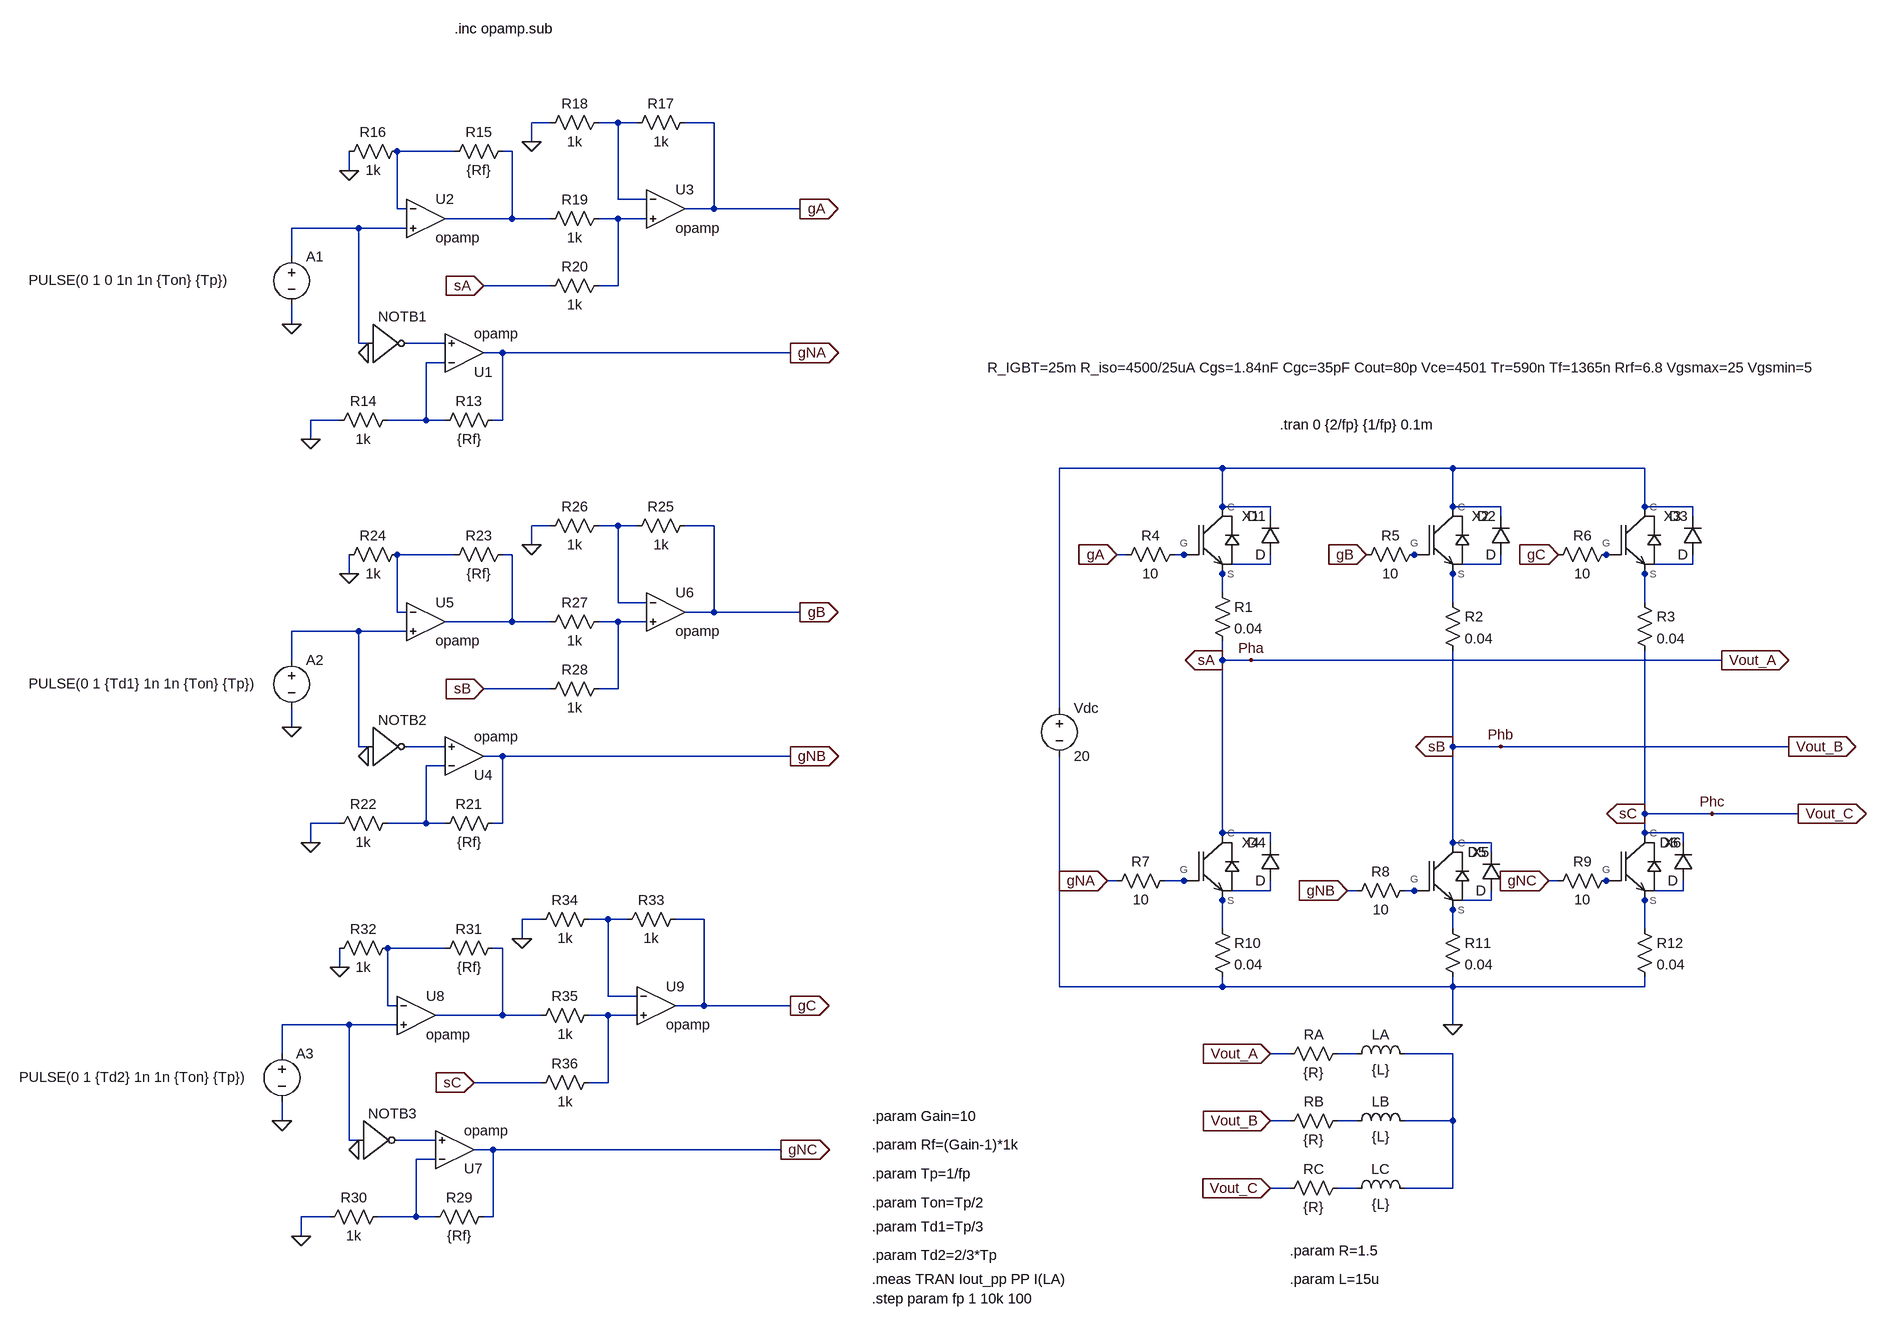
[diagram p0: schematic frequency_study_pp_IGBT.asc]
frequency_study_pp_IGBT.asc, the LTspice schematic file:
Version 4
SHEET 1 3328 1812
WIRE -1840 -1248 -1872 -1248
WIRE -1728 -1248 -1760 -1248
WIRE -1696 -1248 -1728 -1248
WIRE -1568 -1248 -1616 -1248
WIRE -1872 -1216 -1872 -1248
WIRE -2000 -1200 -2096 -1200
WIRE -1904 -1200 -1920 -1200
WIRE -2176 -1168 -2176 -1200
WIRE -1728 -1120 -1728 -1248
WIRE -1680 -1120 -1728 -1120
WIRE -2096 -1104 -2096 -1200
WIRE -2080 -1104 -2096 -1104
WIRE -1568 -1104 -1568 -1248
WIRE -1568 -1104 -1616 -1104
WIRE -1184 -1104 -1568 -1104
WIRE -1904 -1088 -1904 -1200
WIRE -1904 -1088 -2016 -1088
WIRE -1840 -1088 -1904 -1088
WIRE -1728 -1088 -1760 -1088
WIRE -1680 -1088 -1728 -1088
WIRE -2160 -1072 -2272 -1072
WIRE -2080 -1072 -2160 -1072
WIRE -2272 -1024 -2272 -1072
WIRE -1840 -976 -1952 -976
WIRE -1728 -976 -1728 -1088
WIRE -1728 -976 -1760 -976
WIRE -2272 -912 -2272 -944
WIRE -2160 -880 -2160 -1072
WIRE -2144 -880 -2160 -880
WIRE -2016 -880 -2080 -880
WIRE -1920 -864 -1952 -864
WIRE -1200 -864 -1920 -864
WIRE -2016 -848 -2048 -848
WIRE -2192 -752 -2240 -752
WIRE -2048 -752 -2048 -848
WIRE -2048 -752 -2112 -752
WIRE -2016 -752 -2048 -752
WIRE -1920 -752 -1920 -864
WIRE -1920 -752 -1936 -752
WIRE -2240 -720 -2240 -752
WIRE -480 -672 -752 -672
WIRE -96 -672 -480 -672
WIRE 224 -672 -96 -672
WIRE -480 -608 -480 -672
WIRE -400 -608 -480 -608
WIRE -96 -608 -96 -672
WIRE -16 -608 -96 -608
WIRE 224 -608 224 -672
WIRE 304 -608 224 -608
WIRE -400 -592 -400 -608
WIRE -16 -592 -16 -608
WIRE 304 -592 304 -608
WIRE -1840 -576 -1872 -576
WIRE -1728 -576 -1760 -576
WIRE -1696 -576 -1728 -576
WIRE -1568 -576 -1616 -576
WIRE -1872 -544 -1872 -576
WIRE -2000 -528 -2096 -528
WIRE -1904 -528 -1920 -528
WIRE -640 -528 -656 -528
WIRE -544 -528 -560 -528
WIRE -528 -528 -544 -528
WIRE -144 -528 -160 -528
WIRE 176 -528 160 -528
WIRE -400 -512 -400 -528
WIRE -400 -512 -480 -512
WIRE -16 -512 -16 -528
WIRE -16 -512 -96 -512
WIRE 304 -512 304 -528
WIRE 304 -512 224 -512
WIRE -2176 -496 -2176 -528
WIRE -480 -496 -480 -512
WIRE -96 -496 -96 -512
WIRE 224 -496 224 -512
WIRE -480 -464 -480 -496
WIRE -1728 -448 -1728 -576
WIRE -1680 -448 -1728 -448
WIRE -96 -448 -96 -496
WIRE 224 -448 224 -496
WIRE -2096 -432 -2096 -528
WIRE -2080 -432 -2096 -432
WIRE -1568 -432 -1568 -576
WIRE -1568 -432 -1616 -432
WIRE -1184 -432 -1568 -432
WIRE -1904 -416 -1904 -528
WIRE -1904 -416 -2016 -416
WIRE -1840 -416 -1904 -416
WIRE -1728 -416 -1760 -416
WIRE -1680 -416 -1728 -416
WIRE -2160 -400 -2272 -400
WIRE -2080 -400 -2160 -400
WIRE -2272 -352 -2272 -400
WIRE -480 -352 -480 -384
WIRE -432 -352 -480 -352
WIRE 352 -352 -432 -352
WIRE -1840 -304 -1952 -304
WIRE -1728 -304 -1728 -416
WIRE -1728 -304 -1760 -304
WIRE -752 -272 -752 -672
WIRE -2272 -240 -2272 -272
WIRE -2160 -208 -2160 -400
WIRE -2144 -208 -2160 -208
WIRE -2016 -208 -2080 -208
WIRE -96 -208 -96 -368
WIRE -16 -208 -96 -208
WIRE 464 -208 -16 -208
WIRE -1920 -192 -1952 -192
WIRE -1200 -192 -1920 -192
WIRE -2016 -176 -2048 -176
WIRE 224 -96 224 -368
WIRE 336 -96 224 -96
WIRE 480 -96 336 -96
WIRE -2192 -80 -2240 -80
WIRE -2048 -80 -2048 -176
WIRE -2048 -80 -2112 -80
WIRE -2016 -80 -2048 -80
WIRE -1920 -80 -1920 -192
WIRE -1920 -80 -1936 -80
WIRE -480 -64 -480 -352
WIRE -400 -64 -480 -64
WIRE 224 -64 224 -96
WIRE 288 -64 224 -64
WIRE -2240 -48 -2240 -80
WIRE -400 -48 -400 -64
WIRE -96 -48 -96 -208
WIRE -32 -48 -96 -48
WIRE 288 -48 288 -64
WIRE -32 -32 -32 -48
WIRE -656 16 -672 16
WIRE -544 16 -576 16
WIRE -528 16 -544 16
WIRE 80 16 64 16
WIRE 176 16 160 16
WIRE -400 32 -400 16
WIRE -400 32 -480 32
WIRE -256 32 -272 32
WIRE -160 32 -176 32
WIRE -144 32 -160 32
WIRE 288 32 288 16
WIRE 288 32 224 32
WIRE -480 48 -480 32
WIRE -32 48 -32 32
WIRE -32 48 -96 48
WIRE 224 48 224 32
WIRE -96 64 -96 48
WIRE -1856 80 -1888 80
WIRE -1744 80 -1776 80
WIRE -1712 80 -1744 80
WIRE -1584 80 -1632 80
WIRE -480 96 -480 48
WIRE -96 96 -96 64
WIRE 224 96 224 48
WIRE -1888 112 -1888 80
WIRE -2016 128 -2112 128
WIRE -1920 128 -1936 128
WIRE -2192 160 -2192 128
WIRE -752 192 -752 -192
WIRE -480 192 -480 176
WIRE -480 192 -752 192
WIRE -96 192 -96 176
WIRE -96 192 -480 192
WIRE 224 192 224 176
WIRE 224 192 -96 192
WIRE -1744 208 -1744 80
WIRE -1696 208 -1744 208
WIRE -2112 224 -2112 128
WIRE -2096 224 -2112 224
WIRE -1584 224 -1584 80
WIRE -1584 224 -1632 224
WIRE -1200 224 -1584 224
WIRE -1920 240 -1920 128
WIRE -1920 240 -2032 240
WIRE -1856 240 -1920 240
WIRE -1744 240 -1776 240
WIRE -1696 240 -1744 240
WIRE -2176 256 -2288 256
WIRE -2096 256 -2176 256
WIRE -96 256 -96 192
WIRE -2288 304 -2288 256
WIRE -368 304 -400 304
WIRE -256 304 -288 304
WIRE -96 304 -176 304
WIRE -1856 352 -1968 352
WIRE -1744 352 -1744 240
WIRE -1744 352 -1776 352
WIRE -2288 416 -2288 384
WIRE -368 416 -400 416
WIRE -256 416 -288 416
WIRE -96 416 -96 304
WIRE -96 416 -176 416
WIRE -2176 448 -2176 256
WIRE -2160 448 -2176 448
WIRE -2032 448 -2096 448
WIRE -1936 464 -1968 464
WIRE -1216 464 -1936 464
WIRE -2032 480 -2064 480
WIRE -368 528 -400 528
WIRE -256 528 -288 528
WIRE -96 528 -96 416
WIRE -96 528 -176 528
WIRE -2208 576 -2256 576
WIRE -2064 576 -2064 480
WIRE -2064 576 -2128 576
WIRE -2032 576 -2064 576
WIRE -1936 576 -1936 464
WIRE -1936 576 -1952 576
WIRE -2256 608 -2256 576
FLAG -96 256 0
FLAG -432 -352 Pha
FLAG -16 -208 Phb
FLAG 336 -96 Phc
FLAG -672 16 gNA
IOPIN -672 16 In
FLAG -656 -528 gA
IOPIN -656 -528 In
FLAG -240 -528 gB
IOPIN -240 -528 In
FLAG 80 -528 gC
IOPIN 80 -528 In
FLAG -272 32 gNB
IOPIN -272 32 In
FLAG 64 16 gNC
IOPIN 64 16 In
FLAG -400 304 Vout_A
IOPIN -400 304 In
FLAG -400 416 Vout_B
IOPIN -400 416 In
FLAG -400 528 Vout_C
IOPIN -400 528 In
FLAG 352 -352 Vout_A
IOPIN 352 -352 Out
FLAG 464 -208 Vout_B
IOPIN 464 -208 Out
FLAG 480 -96 Vout_C
IOPIN 480 -96 Out
FLAG -480 -352 sA
IOPIN -480 -352 Out
FLAG -96 -208 sB
IOPIN -96 -208 Out
FLAG 224 -96 sC
IOPIN 224 -96 Out
FLAG -1184 -1104 gA
IOPIN -1184 -1104 Out
FLAG -1200 -864 gNA
IOPIN -1200 -864 Out
FLAG -2272 -912 0
FLAG -2144 -864 0
FLAG -2240 -720 0
FLAG -2176 -1168 0
FLAG -1952 -976 sA
IOPIN -1952 -976 In
FLAG -1872 -1216 0
FLAG -1184 -432 gB
IOPIN -1184 -432 Out
FLAG -1200 -192 gNB
IOPIN -1200 -192 Out
FLAG -2272 -240 0
FLAG -2144 -192 0
FLAG -2240 -48 0
FLAG -2176 -496 0
FLAG -1952 -304 sB
IOPIN -1952 -304 In
FLAG -1872 -544 0
FLAG -1200 224 gC
IOPIN -1200 224 Out
FLAG -1216 464 gNC
IOPIN -1216 464 Out
FLAG -2288 416 0
FLAG -2160 464 0
FLAG -2256 608 0
FLAG -2192 160 0
FLAG -1968 352 sC
IOPIN -1968 352 In
FLAG -1888 112 0
SYMBOL voltage -752 -288 R0
WINDOW 123 0 0 Left 0
WINDOW 39 0 0 Left 0
SYMATTR InstName Vdc
SYMATTR Value 20
SYMBOL ind -272 320 R270
WINDOW 0 32 56 VTop 2
WINDOW 3 5 56 VBottom 2
SYMATTR InstName LA
SYMATTR Value {L}
SYMBOL ind -272 432 R270
WINDOW 0 32 56 VTop 2
WINDOW 3 5 56 VBottom 2
SYMATTR InstName LB
SYMATTR Value {L}
SYMBOL ind -272 544 R270
WINDOW 0 32 56 VTop 2
WINDOW 3 5 56 VBottom 2
SYMATTR InstName LC
SYMATTR Value {L}
SYMBOL res -384 320 R270
WINDOW 0 32 56 VTop 2
WINDOW 3 0 56 VBottom 2
SYMATTR InstName RA
SYMATTR Value {R}
SYMBOL res -384 432 R270
WINDOW 0 32 56 VTop 2
WINDOW 3 0 56 VBottom 2
SYMATTR InstName RB
SYMATTR Value {R}
SYMBOL res -384 544 R270
WINDOW 0 32 56 VTop 2
WINDOW 3 0 56 VBottom 2
SYMATTR InstName RC
SYMATTR Value {R}
SYMBOL IGBT_model -512 -512 R0
WINDOW 39 -360 -327 Left 2
SYMATTR SpiceLine R_IGBT=25m R_iso=4500/25uA Cgs=1.84nF Cgc=35pF Cout=80p Vce=4501 Tr=590n Tf=1365n Rrf=6.8 Vgsmax=25 Vgsmin=5
SYMATTR InstName X1
SYMBOL IGBT_model -128 -512 R0
SYMATTR SpiceLine R_IGBT=25m R_iso=4500/25uA Cgs=1.84nF Cgc=35pF Cout=80p Vce=4501 Tr=590n Tf=1365n Rrf=6.8 Vgsmax=25 Vgsmin=5
SYMATTR InstName X2
SYMBOL IGBT_model 192 -512 R0
SYMATTR SpiceLine R_IGBT=25m R_iso=4500/25uA Cgs=1.84nF Cgc=35pF Cout=80p Vce=4501 Tr=590n Tf=1365n Rrf=6.8 Vgsmax=25 Vgsmin=5
SYMATTR InstName X3
SYMBOL IGBT_model -512 32 R0
SYMATTR SpiceLine R_IGBT=25m R_iso=4500/25uA Cgs=1.84nF Cgc=35pF Cout=80p Vce=4501 Tr=590n Tf=1365n Rrf=6.8 Vgsmax=25 Vgsmin=5
SYMATTR InstName X4
SYMBOL IGBT_model -128 48 R0
SYMATTR SpiceLine R_IGBT=25m R_iso=4500/25uA Cgs=1.84nF Cgc=35pF Cout=80p Vce=4501 Tr=590n Tf=1365n Rrf=6.8 Vgsmax=25 Vgsmin=5
SYMATTR InstName X5
SYMBOL IGBT_model 192 32 R0
SYMATTR SpiceLine R_IGBT=25m R_iso=4500/25uA Cgs=1.84nF Cgc=35pF Cout=80p Vce=4501 Tr=590n Tf=1365n Rrf=6.8 Vgsmax=25 Vgsmin=5
SYMATTR InstName X6
SYMBOL res -496 -480 R0
SYMATTR InstName R1
SYMATTR Value 0.04
SYMBOL res -112 -464 R0
SYMATTR InstName R2
SYMATTR Value 0.04
SYMBOL res 208 -464 R0
SYMATTR InstName R3
SYMATTR Value 0.04
SYMBOL res -544 -544 R90
WINDOW 0 0 56 VBottom 2
WINDOW 3 32 56 VTop 2
SYMATTR InstName R4
SYMATTR Value 10
SYMBOL res -144 -544 R90
WINDOW 0 0 56 VBottom 2
WINDOW 3 32 56 VTop 2
SYMATTR InstName R5
SYMATTR Value 10
SYMBOL res 176 -544 R90
WINDOW 0 0 56 VBottom 2
WINDOW 3 32 56 VTop 2
SYMATTR InstName R6
SYMATTR Value 10
SYMBOL res -560 0 R90
WINDOW 0 0 56 VBottom 2
WINDOW 3 32 56 VTop 2
SYMATTR InstName R7
SYMATTR Value 10
SYMBOL res -160 16 R90
WINDOW 0 0 56 VBottom 2
WINDOW 3 32 56 VTop 2
SYMATTR InstName R8
SYMATTR Value 10
SYMBOL res 176 0 R90
WINDOW 0 0 56 VBottom 2
WINDOW 3 32 56 VTop 2
SYMATTR InstName R9
SYMATTR Value 10
SYMBOL res -496 80 R0
SYMATTR InstName R10
SYMATTR Value 0.04
SYMBOL res -112 80 R0
SYMATTR InstName R11
SYMATTR Value 0.04
SYMBOL res 208 80 R0
SYMATTR InstName R12
SYMATTR Value 0.04
SYMBOL voltage -2272 -1040 R0
WINDOW 3 -438 55 Left 2
WINDOW 123 0 0 Left 0
WINDOW 39 0 0 Left 0
SYMATTR Value PULSE(0 1 0 1n 1n {Ton} {Tp})
SYMATTR InstName A1
SYMBOL Digital\\inv -2144 -944 R0
WINDOW 0 16 20 Left 2
SYMATTR InstName NOTB1
SYMBOL OpAmps\\opamp -1984 -800 M180
SYMATTR InstName U1
SYMBOL res -1920 -768 R90
WINDOW 0 0 56 VBottom 2
WINDOW 3 32 56 VTop 2
SYMATTR InstName R13
SYMATTR Value {Rf}
SYMBOL res -2208 -736 R270
WINDOW 0 32 56 VTop 2
WINDOW 3 0 56 VBottom 2
SYMATTR InstName R14
SYMATTR Value 1k
SYMBOL res -1904 -1216 R90
WINDOW 0 0 56 VBottom 2
WINDOW 3 32 56 VTop 2
SYMATTR InstName R15
SYMATTR Value {Rf}
SYMBOL res -2192 -1184 R270
WINDOW 0 32 56 VTop 2
WINDOW 3 0 56 VBottom 2
SYMATTR InstName R16
SYMATTR Value 1k
SYMBOL OpAmps\\opamp -2048 -1152 R0
SYMATTR InstName U2
SYMBOL OpAmps\\opamp -1648 -1168 R0
SYMATTR InstName U3
SYMBOL res -1600 -1264 R90
WINDOW 0 0 56 VBottom 2
WINDOW 3 32 56 VTop 2
SYMATTR InstName R17
SYMATTR Value 1k
SYMBOL res -1744 -1264 R90
WINDOW 0 0 56 VBottom 2
WINDOW 3 32 56 VTop 2
SYMATTR InstName R18
SYMATTR Value 1k
SYMBOL res -1744 -1104 R90
WINDOW 0 0 56 VBottom 2
WINDOW 3 32 56 VTop 2
SYMATTR InstName R19
SYMATTR Value 1k
SYMBOL res -1744 -992 R90
WINDOW 0 0 56 VBottom 2
WINDOW 3 32 56 VTop 2
SYMATTR InstName R20
SYMATTR Value 1k
SYMBOL voltage -2272 -368 R0
WINDOW 3 -438 55 Left 2
WINDOW 123 0 0 Left 0
WINDOW 39 0 0 Left 0
SYMATTR Value PULSE(0 1 {Td1} 1n 1n {Ton} {Tp})
SYMATTR InstName A2
SYMBOL Digital\\inv -2144 -272 R0
WINDOW 0 16 20 Left 2
SYMATTR InstName NOTB2
SYMBOL OpAmps\\opamp -1984 -128 M180
SYMATTR InstName U4
SYMBOL res -1920 -96 R90
WINDOW 0 0 56 VBottom 2
WINDOW 3 32 56 VTop 2
SYMATTR InstName R21
SYMATTR Value {Rf}
SYMBOL res -2208 -64 R270
WINDOW 0 32 56 VTop 2
WINDOW 3 0 56 VBottom 2
SYMATTR InstName R22
SYMATTR Value 1k
SYMBOL res -1904 -544 R90
WINDOW 0 0 56 VBottom 2
WINDOW 3 32 56 VTop 2
SYMATTR InstName R23
SYMATTR Value {Rf}
SYMBOL res -2192 -512 R270
WINDOW 0 32 56 VTop 2
WINDOW 3 0 56 VBottom 2
SYMATTR InstName R24
SYMATTR Value 1k
SYMBOL OpAmps\\opamp -2048 -480 R0
SYMATTR InstName U5
SYMBOL OpAmps\\opamp -1648 -496 R0
SYMATTR InstName U6
SYMBOL res -1600 -592 R90
WINDOW 0 0 56 VBottom 2
WINDOW 3 32 56 VTop 2
SYMATTR InstName R25
SYMATTR Value 1k
SYMBOL res -1744 -592 R90
WINDOW 0 0 56 VBottom 2
WINDOW 3 32 56 VTop 2
SYMATTR InstName R26
SYMATTR Value 1k
SYMBOL res -1744 -432 R90
WINDOW 0 0 56 VBottom 2
WINDOW 3 32 56 VTop 2
SYMATTR InstName R27
SYMATTR Value 1k
SYMBOL res -1744 -320 R90
WINDOW 0 0 56 VBottom 2
WINDOW 3 32 56 VTop 2
SYMATTR InstName R28
SYMATTR Value 1k
SYMBOL voltage -2288 288 R0
WINDOW 3 -438 55 Left 2
WINDOW 123 0 0 Left 0
WINDOW 39 0 0 Left 0
SYMATTR Value PULSE(0 1 {Td2} 1n 1n {Ton} {Tp})
SYMATTR InstName A3
SYMBOL Digital\\inv -2160 384 R0
WINDOW 0 16 20 Left 2
SYMATTR InstName NOTB3
SYMBOL OpAmps\\opamp -2000 528 M180
SYMATTR InstName U7
SYMBOL res -1936 560 R90
WINDOW 0 0 56 VBottom 2
WINDOW 3 32 56 VTop 2
SYMATTR InstName R29
SYMATTR Value {Rf}
SYMBOL res -2224 592 R270
WINDOW 0 32 56 VTop 2
WINDOW 3 0 56 VBottom 2
SYMATTR InstName R30
SYMATTR Value 1k
SYMBOL res -1920 112 R90
WINDOW 0 0 56 VBottom 2
WINDOW 3 32 56 VTop 2
SYMATTR InstName R31
SYMATTR Value {Rf}
SYMBOL res -2208 144 R270
WINDOW 0 32 56 VTop 2
WINDOW 3 0 56 VBottom 2
SYMATTR InstName R32
SYMATTR Value 1k
SYMBOL OpAmps\\opamp -2064 176 R0
SYMATTR InstName U8
SYMBOL OpAmps\\opamp -1664 160 R0
SYMATTR InstName U9
SYMBOL res -1616 64 R90
WINDOW 0 0 56 VBottom 2
WINDOW 3 32 56 VTop 2
SYMATTR InstName R33
SYMATTR Value 1k
SYMBOL res -1760 64 R90
WINDOW 0 0 56 VBottom 2
WINDOW 3 32 56 VTop 2
SYMATTR InstName R34
SYMATTR Value 1k
SYMBOL res -1760 224 R90
WINDOW 0 0 56 VBottom 2
WINDOW 3 32 56 VTop 2
SYMATTR InstName R35
SYMATTR Value 1k
SYMBOL res -1760 336 R90
WINDOW 0 0 56 VBottom 2
WINDOW 3 32 56 VTop 2
SYMATTR InstName R36
SYMATTR Value 1k
SYMBOL diode -384 -528 R180
WINDOW 0 24 64 Left 2
WINDOW 3 24 0 Left 2
SYMATTR InstName D1
SYMBOL diode 0 -528 R180
WINDOW 0 24 64 Left 2
WINDOW 3 24 0 Left 2
SYMATTR InstName D2
SYMBOL diode 320 -528 R180
WINDOW 0 24 64 Left 2
WINDOW 3 24 0 Left 2
SYMATTR InstName D3
SYMBOL diode -384 16 R180
WINDOW 0 24 64 Left 2
WINDOW 3 24 0 Left 2
SYMATTR InstName D4
SYMBOL diode -16 32 R180
WINDOW 0 24 64 Left 2
WINDOW 3 24 0 Left 2
SYMATTR InstName D5
SYMBOL diode 304 16 R180
WINDOW 0 24 64 Left 2
WINDOW 3 24 0 Left 2
SYMATTR InstName D6
TEXT -384 -744 Left 2 !.tran 0 {2/fp} {1/fp} 0.1m
TEXT -368 632 Left 2 !.param R=1.5
TEXT -368 680 Left 2 !.param L=15u
TEXT -1064 712 Left 2 !.step param fp 1 10k 100
TEXT -1064 456 Left 2 !.param Rf=(Gain-1)*1k
TEXT -1064 504 Left 2 !.param Tp=1/fp
TEXT -1064 552 Left 2 !.param Ton=Tp/2
TEXT -1064 592 Left 2 !.param Td1=Tp/3
TEXT -1064 640 Left 2 !.param Td2=2/3*Tp
TEXT -1064 408 Left 2 !.param Gain=10
TEXT -2000 -1408 Left 2 !.inc opamp.sub
TEXT -1064 680 Left 2 !.meas TRAN Iout_pp PP I(LA)

The netlist it stands for:
* frequency_study_pp_IGBT.asc
Vdc N008 0 20
LA N033 N034 {L}
LB N035 N034 {L}
LC N038 N034 {L}
RA sA N033 {R}
RB sB N035 {R}
RC sC N038 {R}
XX1 N008 N012 N015 IGBT_model params: R_IGBT=25m R_iso=4500/25uA Cgs=1.84nF Cgc=35pF Cout=80p Vce=4501 Tr=590n Tf=1365n Rrf=6.8 Vgsmax=25 Vgsmin=5  ; pins C G S
XX2 N008 N013 N016 IGBT_model params: R_IGBT=25m R_iso=4500/25uA Cgs=1.84nF Cgc=35pF Cout=80p Vce=4501 Tr=590n Tf=1365n Rrf=6.8 Vgsmax=25 Vgsmin=5  ; pins C G S
XX3 N008 N014 N017 IGBT_model params: R_IGBT=25m R_iso=4500/25uA Cgs=1.84nF Cgc=35pF Cout=80p Vce=4501 Tr=590n Tf=1365n Rrf=6.8 Vgsmax=25 Vgsmin=5  ; pins C G S
XX4 sA N022 N024 IGBT_model params: R_IGBT=25m R_iso=4500/25uA Cgs=1.84nF Cgc=35pF Cout=80p Vce=4501 Tr=590n Tf=1365n Rrf=6.8 Vgsmax=25 Vgsmin=5  ; pins C G S
XX5 sB N025 N027 IGBT_model params: R_IGBT=25m R_iso=4500/25uA Cgs=1.84nF Cgc=35pF Cout=80p Vce=4501 Tr=590n Tf=1365n Rrf=6.8 Vgsmax=25 Vgsmin=5  ; pins C G S
XX6 sC N023 N026 IGBT_model params: R_IGBT=25m R_iso=4500/25uA Cgs=1.84nF Cgc=35pF Cout=80p Vce=4501 Tr=590n Tf=1365n Rrf=6.8 Vgsmax=25 Vgsmin=5  ; pins C G S
R1 N015 sA 0.04
R2 N016 sB 0.04
R3 N017 sC 0.04
R4 N012 gA 10
R5 N013 gB 10
R6 N014 gC 10
R7 N022 gNA 10
R8 N025 gNB 10
R9 N023 gNC 10
R10 N024 0 0.04
R11 N027 0 0.04
R12 N026 0 0.04
V§A1 N005 0 PULSE(0 1 0 1n 1n {Ton} {Tp})
A§NOTB1 N005 0 0 0 0 N006 0 0 BUF
XU1 N007 N006 gNA opamp Aol=100K GBW=10Meg  ; pins invin noninvin out
R13 gNA N007 {Rf}
R14 0 N007 1k
R15 N003 N002 {Rf}
R16 0 N002 1k
XU2 N002 N005 N003 opamp Aol=100K GBW=10Meg  ; pins invin noninvin out
XU3 N001 N004 gA opamp Aol=100K GBW=10Meg  ; pins invin noninvin out
R17 gA N001 1k
R18 N001 0 1k
R19 N004 N003 1k
R20 N004 sA 1k
V§A2 N019 0 PULSE(0 1 {Td1} 1n 1n {Ton} {Tp})
A§NOTB2 N019 0 0 0 0 N020 0 0 BUF
XU4 N021 N020 gNB opamp Aol=100K GBW=10Meg  ; pins invin noninvin out
R21 gNB N021 {Rf}
R22 0 N021 1k
R23 N011 N010 {Rf}
R24 0 N010 1k
XU5 N010 N019 N011 opamp Aol=100K GBW=10Meg  ; pins invin noninvin out
XU6 N009 N018 gB opamp Aol=100K GBW=10Meg  ; pins invin noninvin out
R25 gB N009 1k
R26 N009 0 1k
R27 N018 N011 1k
R28 N018 sB 1k
V§A3 N032 0 PULSE(0 1 {Td2} 1n 1n {Ton} {Tp})
A§NOTB3 N032 0 0 0 0 N036 0 0 BUF
XU7 N037 N036 gNC opamp Aol=100K GBW=10Meg  ; pins invin noninvin out
R29 gNC N037 {Rf}
R30 0 N037 1k
R31 N030 N029 {Rf}
R32 0 N029 1k
XU8 N029 N032 N030 opamp Aol=100K GBW=10Meg  ; pins invin noninvin out
XU9 N028 N031 gC opamp Aol=100K GBW=10Meg  ; pins invin noninvin out
R33 gC N028 1k
R34 N028 0 1k
R35 N031 N030 1k
R36 N031 sC 1k
D1 N015 N008 D
D2 N016 N008 D
D3 N017 N008 D
D4 N024 sA D
D5 N027 sB D
D6 N026 sC D
.model D D
.lib standard.dio
.tran 0 {2/fp} {1/fp} 0.1m
.param R=1.5
.param L=15u
.step param fp 1 10k 100
.param Rf=(Gain-1)*1k
.param Tp=1/fp
.param Ton=Tp/2
.param Td1=Tp/3
.param Td2=2/3*Tp
.param Gain=10
.inc opamp.sub
.meas TRAN Iout_pp PP I(LA)
.backanno
.end